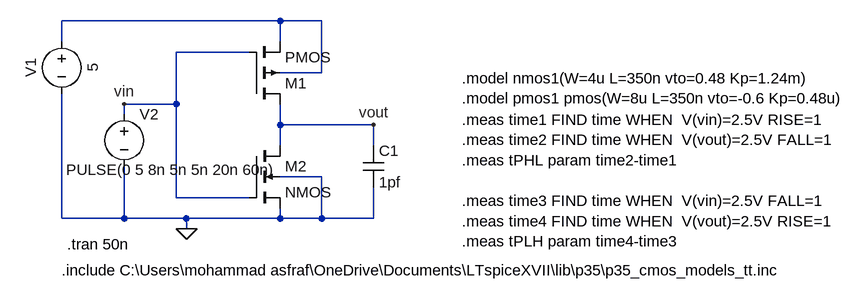
[diagram p0: schematic CMOS_Inv_Trans.asc]
CMOS_Inv_Trans.asc, the LTspice schematic file:
Version 4
SHEET 1 1056 680
WIRE 336 -64 0 -64
WIRE 400 -64 336 -64
WIRE 0 -32 0 -64
WIRE 336 -32 336 -64
WIRE 288 -16 176 -16
WIRE 400 16 400 -64
WIRE 400 16 336 16
WIRE 176 64 176 -16
WIRE 176 64 96 64
WIRE 96 80 96 64
WIRE 336 96 336 64
WIRE 480 96 336 96
WIRE 336 128 336 96
WIRE 480 128 480 96
WIRE 400 176 336 176
WIRE 176 208 176 64
WIRE 288 208 176 208
WIRE 0 240 0 48
WIRE 96 240 96 160
WIRE 96 240 0 240
WIRE 192 240 96 240
WIRE 336 240 336 224
WIRE 336 240 192 240
WIRE 400 240 400 176
WIRE 400 240 336 240
WIRE 480 240 480 192
WIRE 480 240 400 240
WIRE 192 256 192 240
FLAG 192 256 0
FLAG 480 96 vout
FLAG 96 64 vin
SYMBOL voltage 0 -48 R0
WINDOW 0 -32 56 VBottom 2
WINDOW 3 32 56 VTop 2
WINDOW 123 0 0 Left 0
WINDOW 39 0 0 Left 0
SYMATTR InstName V1
SYMATTR Value 5
SYMBOL voltage 96 64 R0
WINDOW 123 0 0 Left 0
WINDOW 39 0 0 Left 0
WINDOW 3 -89 101 Left 2
SYMATTR Value PULSE(0 5 8n 5n 5n 20n 60n)
SYMATTR InstName V2
SYMBOL cap 464 128 R0
SYMATTR InstName C1
SYMATTR Value 1pf
SYMBOL pmos4 288 64 M180
SYMATTR InstName M1
SYMATTR Value2 l=350n w=8u
SYMBOL nmos4 288 128 R0
SYMATTR InstName M2
SYMATTR Value2 l=350n w=4u
TEXT 0 320 Left 2 !.include C:\\Users\\mohammad asfraf\\OneDrive\\Documents\\LTspiceXVII\\lib\\p35\\p35_cmos_models_tt.inc
TEXT 616 88 Left 2 !.meas time1 FIND time WHEN  V(vin)=2.5V RISE=1\n.meas time2 FIND time WHEN  V(vout)=2.5V FALL=1\n.meas tPHL param time2-time1\n \n.meas time3 FIND time WHEN  V(vin)=2.5V FALL=1\n.meas time4 FIND time WHEN  V(vout)=2.5V RISE=1\n.meas tPLH param time4-time3
TEXT 616 24 Left 2 !.model nmos1(W=4u L=350n vto=0.48 Kp=1.24m)\n.model pmos1 pmos(W=8u L=350n vto=-0.6 Kp=0.48u)
TEXT 8 280 Left 2 !.tran 50n

The netlist it stands for:
* CMOS_Inv_Trans.asc
V1 N001 0 5
V2 vin 0 PULSE(0 5 8n 5n 5n 20n 60n)
C1 vout 0 1pf
M1 vout vin N001 N001 PMOS l=350n w=8u
M2 vout vin 0 0 NMOS l=350n w=4u
.model NMOS NMOS
.model PMOS PMOS
.lib standard.mos
.include C:\Users\mohammad asfraf\OneDrive\Documents\LTspiceXVII\lib\p35\p35_cmos_models_tt.inc
.meas time1 FIND time WHEN  V(vin)=2.5V RISE=1
.meas time2 FIND time WHEN  V(vout)=2.5V FALL=1
.meas tPHL param time2-time1
.meas time3 FIND time WHEN  V(vin)=2.5V FALL=1
.meas time4 FIND time WHEN  V(vout)=2.5V RISE=1
.meas tPLH param time4-time3
.model nmos1(W=4u L=350n vto=0.48 Kp=1.24m)
.model pmos1 pmos(W=8u L=350n vto=-0.6 Kp=0.48u)
.tran 50n
.backanno
.end